# Altium schematic sheet SZ.SchDoc
size A3
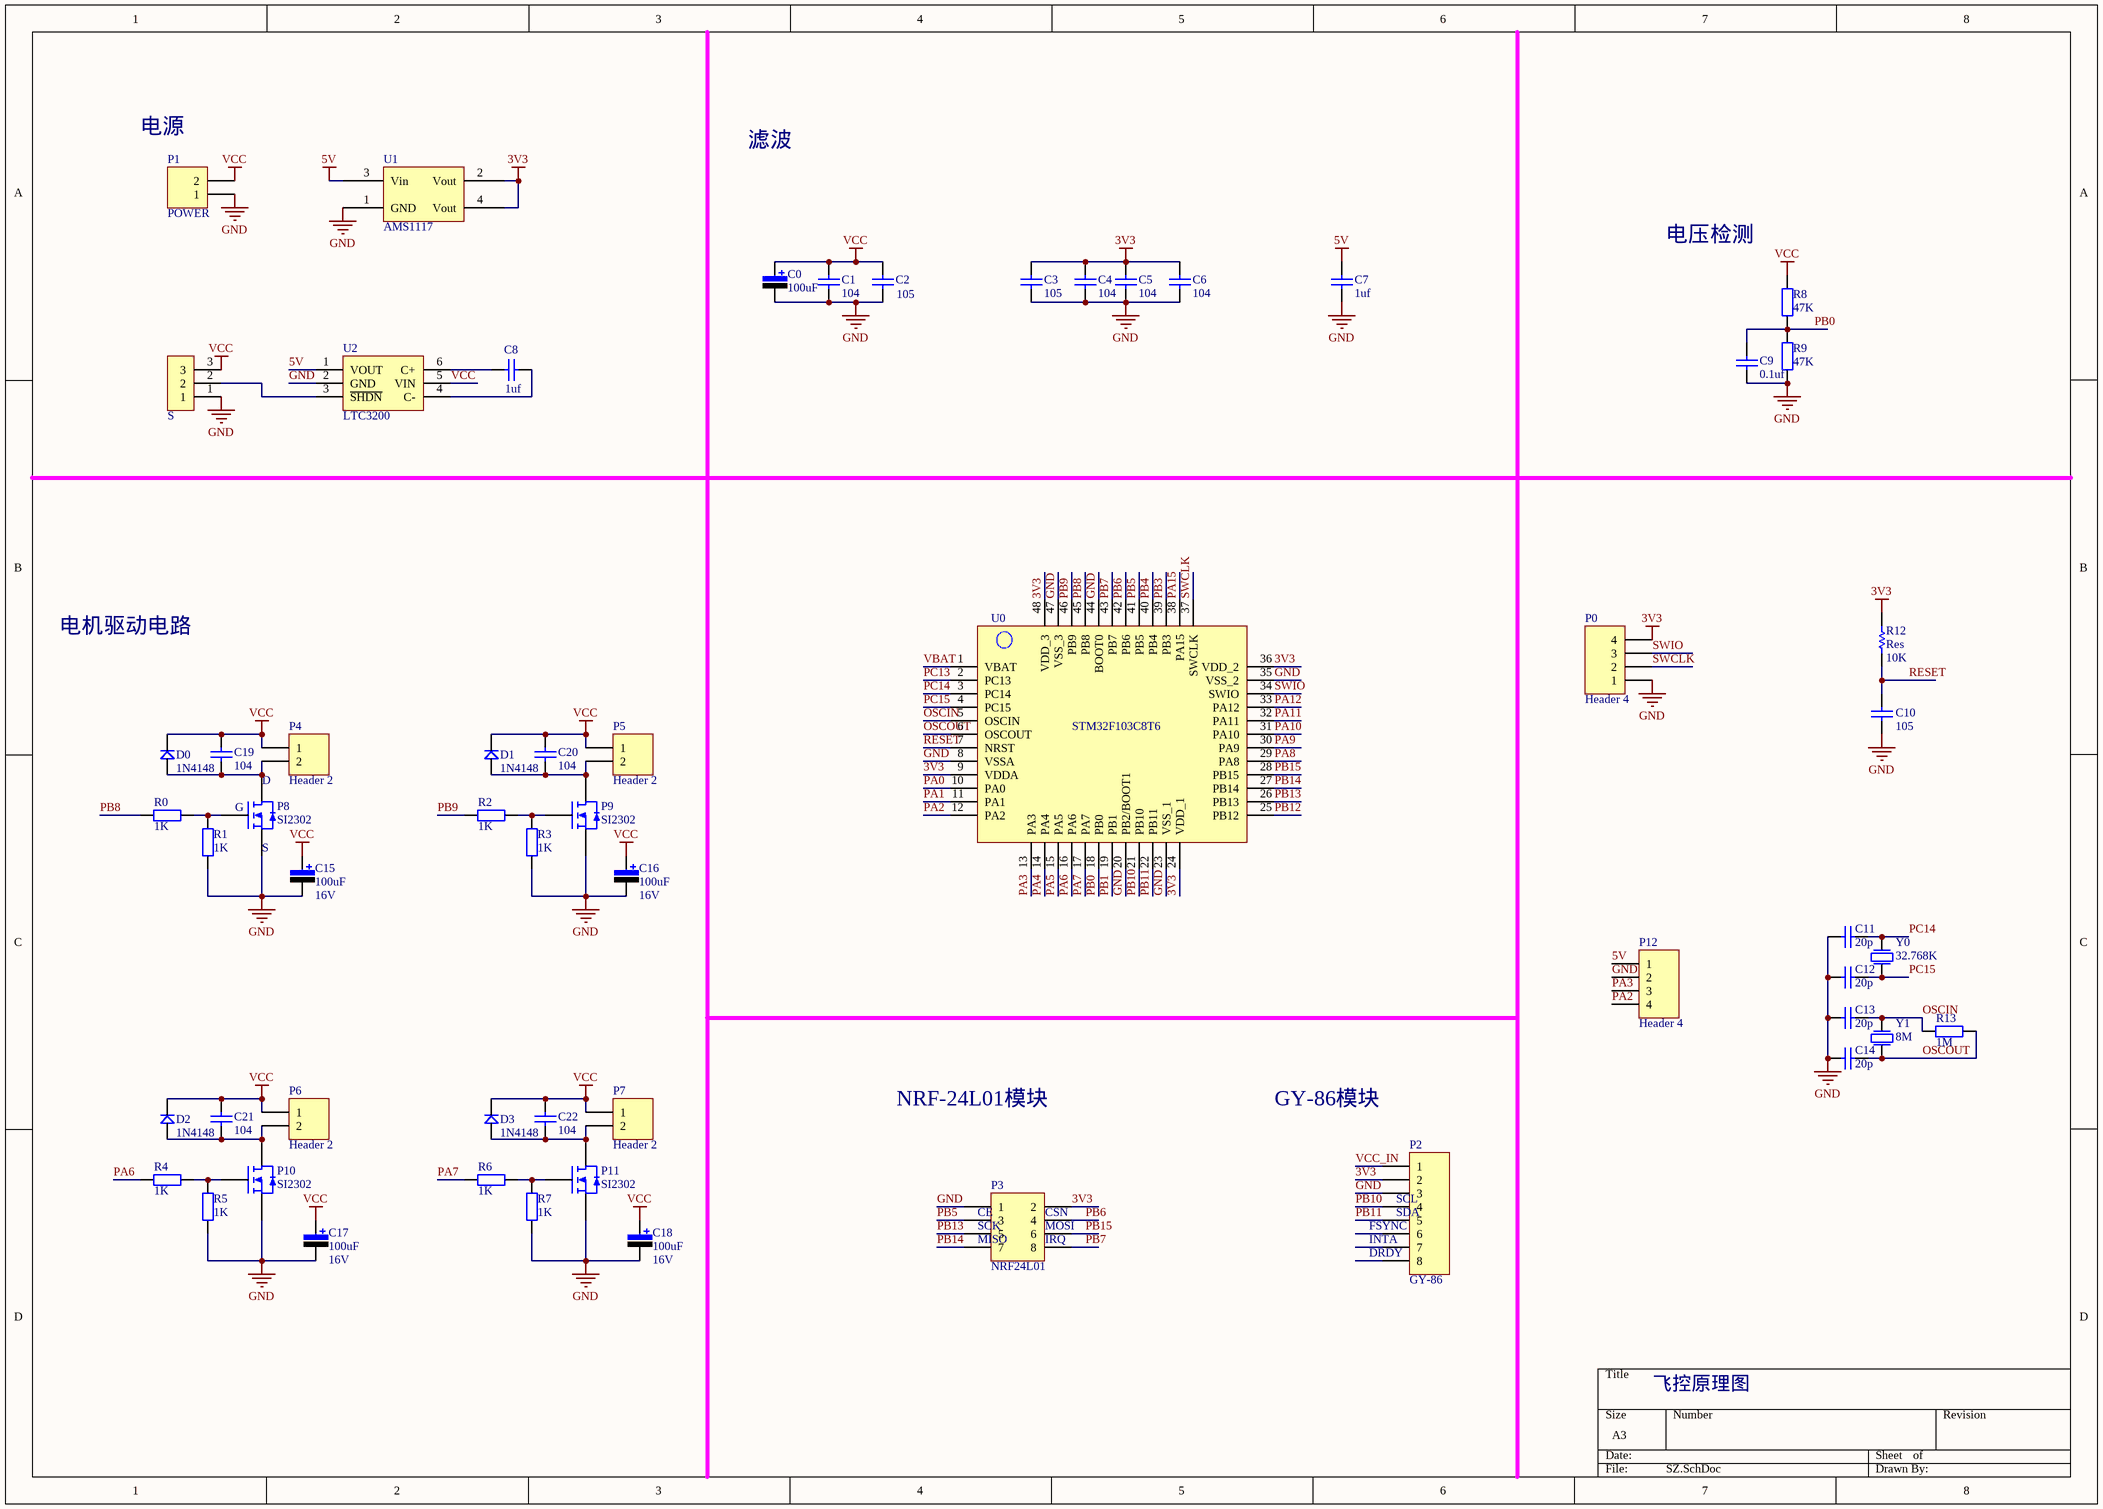
[diagram p0: SZ.SchDoc]

## Parts
C0  value 100uF  [1206C]  (hidden comment: Cap Pol)
C1  104  [C0603]
C2  value 105  [C0603]  (hidden comment: Cap)
C3  value 105  [C0603]  (hidden comment: Cap)
C4  value 104  [C0603]  (hidden comment: Cap)
C5  value 104  [C0603]  (hidden comment: Cap)
C6  value 104  [C0603]  (hidden comment: Cap)
C7  value 1uf  [C0603]  (hidden comment: Cap)
C8  value 1uf  [C0603]  (hidden comment: Cap)
C9  value 0.1uf  [C0603]  (hidden comment: Cap)
C10  value 105  [C0603]  (hidden comment: Cap)
C11  value 20p  [C0603]  (hidden comment: Cap)
C12  20p  [C0603]
C13  20p  [C0603]
C14  20p  [C0603]
C15  value 100uF  Vol: 16V  [1206C]  (hidden comment: Cap Pol)
C16  value 100uF  Vol: 16V  [1206C]  (hidden comment: Cap Pol)
C17  value 100uF  Vol: 16V  [1206C]  (hidden comment: Cap Pol)
C18  value 100uF  Vol: 16V  [1206C]  (hidden comment: Cap Pol)
C19  value 104  [C0603]  (hidden comment: Cap)
C20  104  [C0603]
C21  104  [C0603]
C22  104  [C0603]
D0  1N4148  [L0603]
D1  1N4148  [L0603]
D2  1N4148  [L0603]
D3  1N4148  [L0603]
P0  Header 4  [HDR1X4]
P1  POWER  [HDR1X2]
P2  GY-86  [HDR1X8]
P3  NRF24L01  [HDR2X4]
P4  Header 2  [HDR1X2]
P5  Header 2  [HDR1X2]
P6  Header 2  [HDR1X2]
P7  Header 2  [HDR1X2]
P8  SI2302  [SOT-23B_N]
P9  SI2302  [SOT-23B_N]
P10  SI2302  [SOT-23B_N]
P11  SI2302  [SOT-23B_N]
P12  Header 4  [HDR1X4]
R0  1k  [0603_R]
R1  1K  [0603_R]
R2  value 1K  [0603_R]  (hidden comment: Res1)
R3  value 1K  [0603_R]  (hidden comment: Res1)
R4  value 1K  [0603_R]  (hidden comment: Res1)
R5  value 1K  [0603_R]  (hidden comment: Res1)
R6  value 1K  [0603_R]  (hidden comment: Res1)
R7  value 1K  [0603_R]  (hidden comment: Res1)
R8  value 47K  [0603_R]  (hidden comment: Res1)
R9  value 47K  [0603_R]  (hidden comment: Res1)
R12  Res  value 10K  [0603_R]
R13  value 1M  [0603_R]  (hidden comment: Res2)
S  HEADER 3  [HDR1X3]  (value not drawn)
U0  Component_1  [LQFP-48_7x7x05P]  (value not drawn)
U1  AMS1117  [SOT223_N]
U2  LTC3200  [SOT-23-6]
Y0  32.768K  [HDR1X2]
Y1  8M  [XTAL-RAD-0.2]

## Nets
3V3: C3.2 C4.2 C5.2 C6.2 P0.4 P2.2 P3.2 R12.2 U0.9(VDDA) U0.24(VDD_1) U0.36(VDD_2) U0.48(VDD_3) U1.2(Vout) U1.4(Vout)
5V: C7.1 P12.1 U1.3(Vin) U2.1(VOUT)
GND: C0.2 C1.1 C2.2 C3.1 C4.1 C5.1 C6.1 C7.2 C9.1 C10.1 C11.1 C12.1 C13.1 C14.1 C15.2 C16.2 C17.2 C18.2 P0.1 P1.1 P2.3 P3.1 P8.2 P9.2 P10.2 P11.2 P12.2 R1.1 R3.1 R5.1 R7.1 R9.1 S.1 U0.8(VSSA) U0.20(PB2/BOOT1) U0.23(VSS_1) U0.35(VSS_2) U0.44(BOOT0) U0.47(VSS_3) U1.1(GND) U2.2(GND)
VCC: C0.1 C1.2 C2.1 C15.1 C16.1 C17.1 C18.1 C19.1 C20.2 C21.2 C22.2 D0.2 D1.2 D2.2 D3.2 P1.2 P4.1 P5.1 P6.1 P7.1 R8.2 S.3 U2.5(VIN)
OSCIN: C13.2 R13.2 U0.5(OSCIN) Y1.2
OSCOUT: C14.2 R13.1 U0.6(OSCOUT) Y1.1
PA0: U0.10(PA0)
PA1: U0.11(PA1)
PA2: P12.4 U0.12(PA2)
PA3: P12.3 U0.13(PA3)
PA4: U0.14(PA4)
PA5: U0.15(PA5)
PA6: R4.2 U0.16(PA6)
PA7: R6.2 U0.17(PA7)
PA8: U0.29(PA8)
PA9: U0.30(PA9)
PA10: U0.31(PA10)
PA11: U0.32(PA11)
PA12: U0.33(PA12)
PA15: U0.38(PA15)
PB0: C9.2 R8.1 R9.2 U0.18(PB0)
PB1: U0.19(PB1)
PB3: U0.39(PB3)
PB4: U0.40(PB4)
PB5: P3.3 U0.41(PB5)
PB6: P3.4 U0.42(PB6)
PB7: P3.8 U0.43(PB7)
PB8: R0.1 U0.45(PB8)
PB9: R2.1 U0.46(PB9)
PB10: P2.4 U0.21(PB10)
PB11: P2.5 U0.22(PB11)
PB12: U0.25(PB12)
PB13: P3.5 U0.26(PB13)
PB14: P3.7 U0.27(PB14)
PB15: P3.6 U0.28(PB15)
PC13: U0.2(PC13)
PC14: C11.2 U0.3(PC14) Y0.2
PC15: C12.2 U0.4(PC15) Y0.1
RESET: C10.2 R12.1 U0.7(NRST)
SWCLK: P0.2 U0.37(SWCLK)
SWIO: P0.3 U0.34(SWIO)
VBAT: U0.1(VBAT)
VCC_IN: P2.1
NetC8_1: C8.1 U2.6(C+)
NetC8_2: C8.2 U2.4(C-)
NetC19_2: C19.2 D0.1 P4.2 P8.3
NetC20_1: C20.1 D1.1 P5.2 P9.3
NetC21_1: C21.1 D2.1 P6.2 P10.3
NetC22_1: C22.1 D3.1 P7.2 P11.3
NetP8_1: P8.1 R0.2 R1.2
NetP9_1: P9.1 R2.2 R3.2
NetP10_1: P10.1 R4.1 R5.2
NetP11_1: P11.1 R6.1 R7.2
NetS_2: S.2 U2.3(~{SHDN})

Not connected (* = marked no-connect by the designer): P2 6 7 8

## Notes on the sheet
- 电源
- 滤波
- 电压检测
- 电机驱动电路
- (near P8) D
- (near P8) G
- (near P8) S
- NRF-24L01模块
- GY-86模块
- (near P3) CE
- (near P3) SCK
- (near P3) MISO
- (near P3) CSN
- (near P3) MOSI
- (near P3) IRQ
- (near P2) FSYNC
- (near P2) INTA
- (near P2) DRDY
- (near P2) SCL
- (near P2) SDA
- 飞控原理图
- (in symbol Component_1) STM32F103C8T6

## Library data of the parts
C0 = Cap Pol: 极性电解电容; Vol: 16V; Published: 8-Jun-2000; LatestRevisionDate: 17-Jul-2002; LatestRevisionNote: Re-released for DXP Platform.; PackageReference: RB7.6-15; Publisher: Altium Limited
C1 C12-C14 C20-C22 = CAP: Capacitor; Published: 8-Jun-2000; Revision: July-2002: Re-released for DXP Platform.; Publisher: Altium Limited
C2 C10 = Cap: 贴片电容; Published: 8-Jun-2000; LatestRevisionDate: 17-Jul-2002; LatestRevisionNote: Re-released for DXP Platform.; PackageReference: RAD-0.3; Publisher: Altium Limited
C3-C7 C9 C11 = Cap: 无极性电容; Published: 8-Jun-2000; LatestRevisionDate: 17-Jul-2002; LatestRevisionNote: Re-released for DXP Platform.; PackageReference: RAD-0.3; Publisher: Altium Limited
C8 C19 = Cap: Capacitor; Published: 8-Jun-2000; LatestRevisionDate: 17-Jul-2002; LatestRevisionNote: Re-released for DXP Platform.; PackageReference: RAD-0.3; Publisher: Altium Limited; PackageDescription: Radial Cap, Thru-Hole; 2 Leads; 0.3 in Pin Spacing
C15-C18 = Cap Pol: 极性电解电容; Published: 8-Jun-2000; LatestRevisionDate: 17-Jul-2002; LatestRevisionNote: Re-released for DXP Platform.; PackageReference: RB7.6-15; Publisher: Altium Limited
D0-D3 = D
P0 P12 = Header 4: Header, 4-Pin; LatestRevisionDate: 17-Jul-2002; LatestRevisionNote: Re-released for DXP Platform.; Publisher: Altium Limited
P1 P4-P7 = Header 2: Header, 2-Pin; LatestRevisionDate: 17-Jul-2002; LatestRevisionNote: Re-released for DXP Platform.; Publisher: Altium Limited
P2 = Header 8: Header, 8-Pin; LatestRevisionDate: 17-Jul-2002; LatestRevisionNote: Re-released for DXP Platform.; Publisher: Altium Limited
P3 = Header 4X2: Header, 4-Pin, Dual row; LatestRevisionDate: 17-Jul-2002; LatestRevisionNote: Re-released for DXP Platform.; Publisher: Altium Limited
R0-R9 = Res1: 贴片电阻; Published: 8-Jun-2000; LatestRevisionDate: 17-Jul-2002; LatestRevisionNote: Re-released for DXP Platform.; PackageReference: AXIAL-0.4; Publisher: Altium Limited
  R0 R1: Value: 1K
R12 = Res: 贴片电阻; Published: 8-Jun-2000; LatestRevisionDate: 17-Jul-2002; LatestRevisionNote: Re-released for DXP Platform.; PackageReference: AXIAL-0.3; Publisher: Altium Limited
R13 = Res2: Resistor; Published: 8-Jun-2000; LatestRevisionDate: 17-Jul-2002; LatestRevisionNote: Re-released for DXP Platform.; Publisher: Altium Limited
Y0 Y1 = XTAL